# Altium schematic sheet Power.SchDoc
size 431 x 279 mm; SheetNumber: 2; SheetTotal: 6
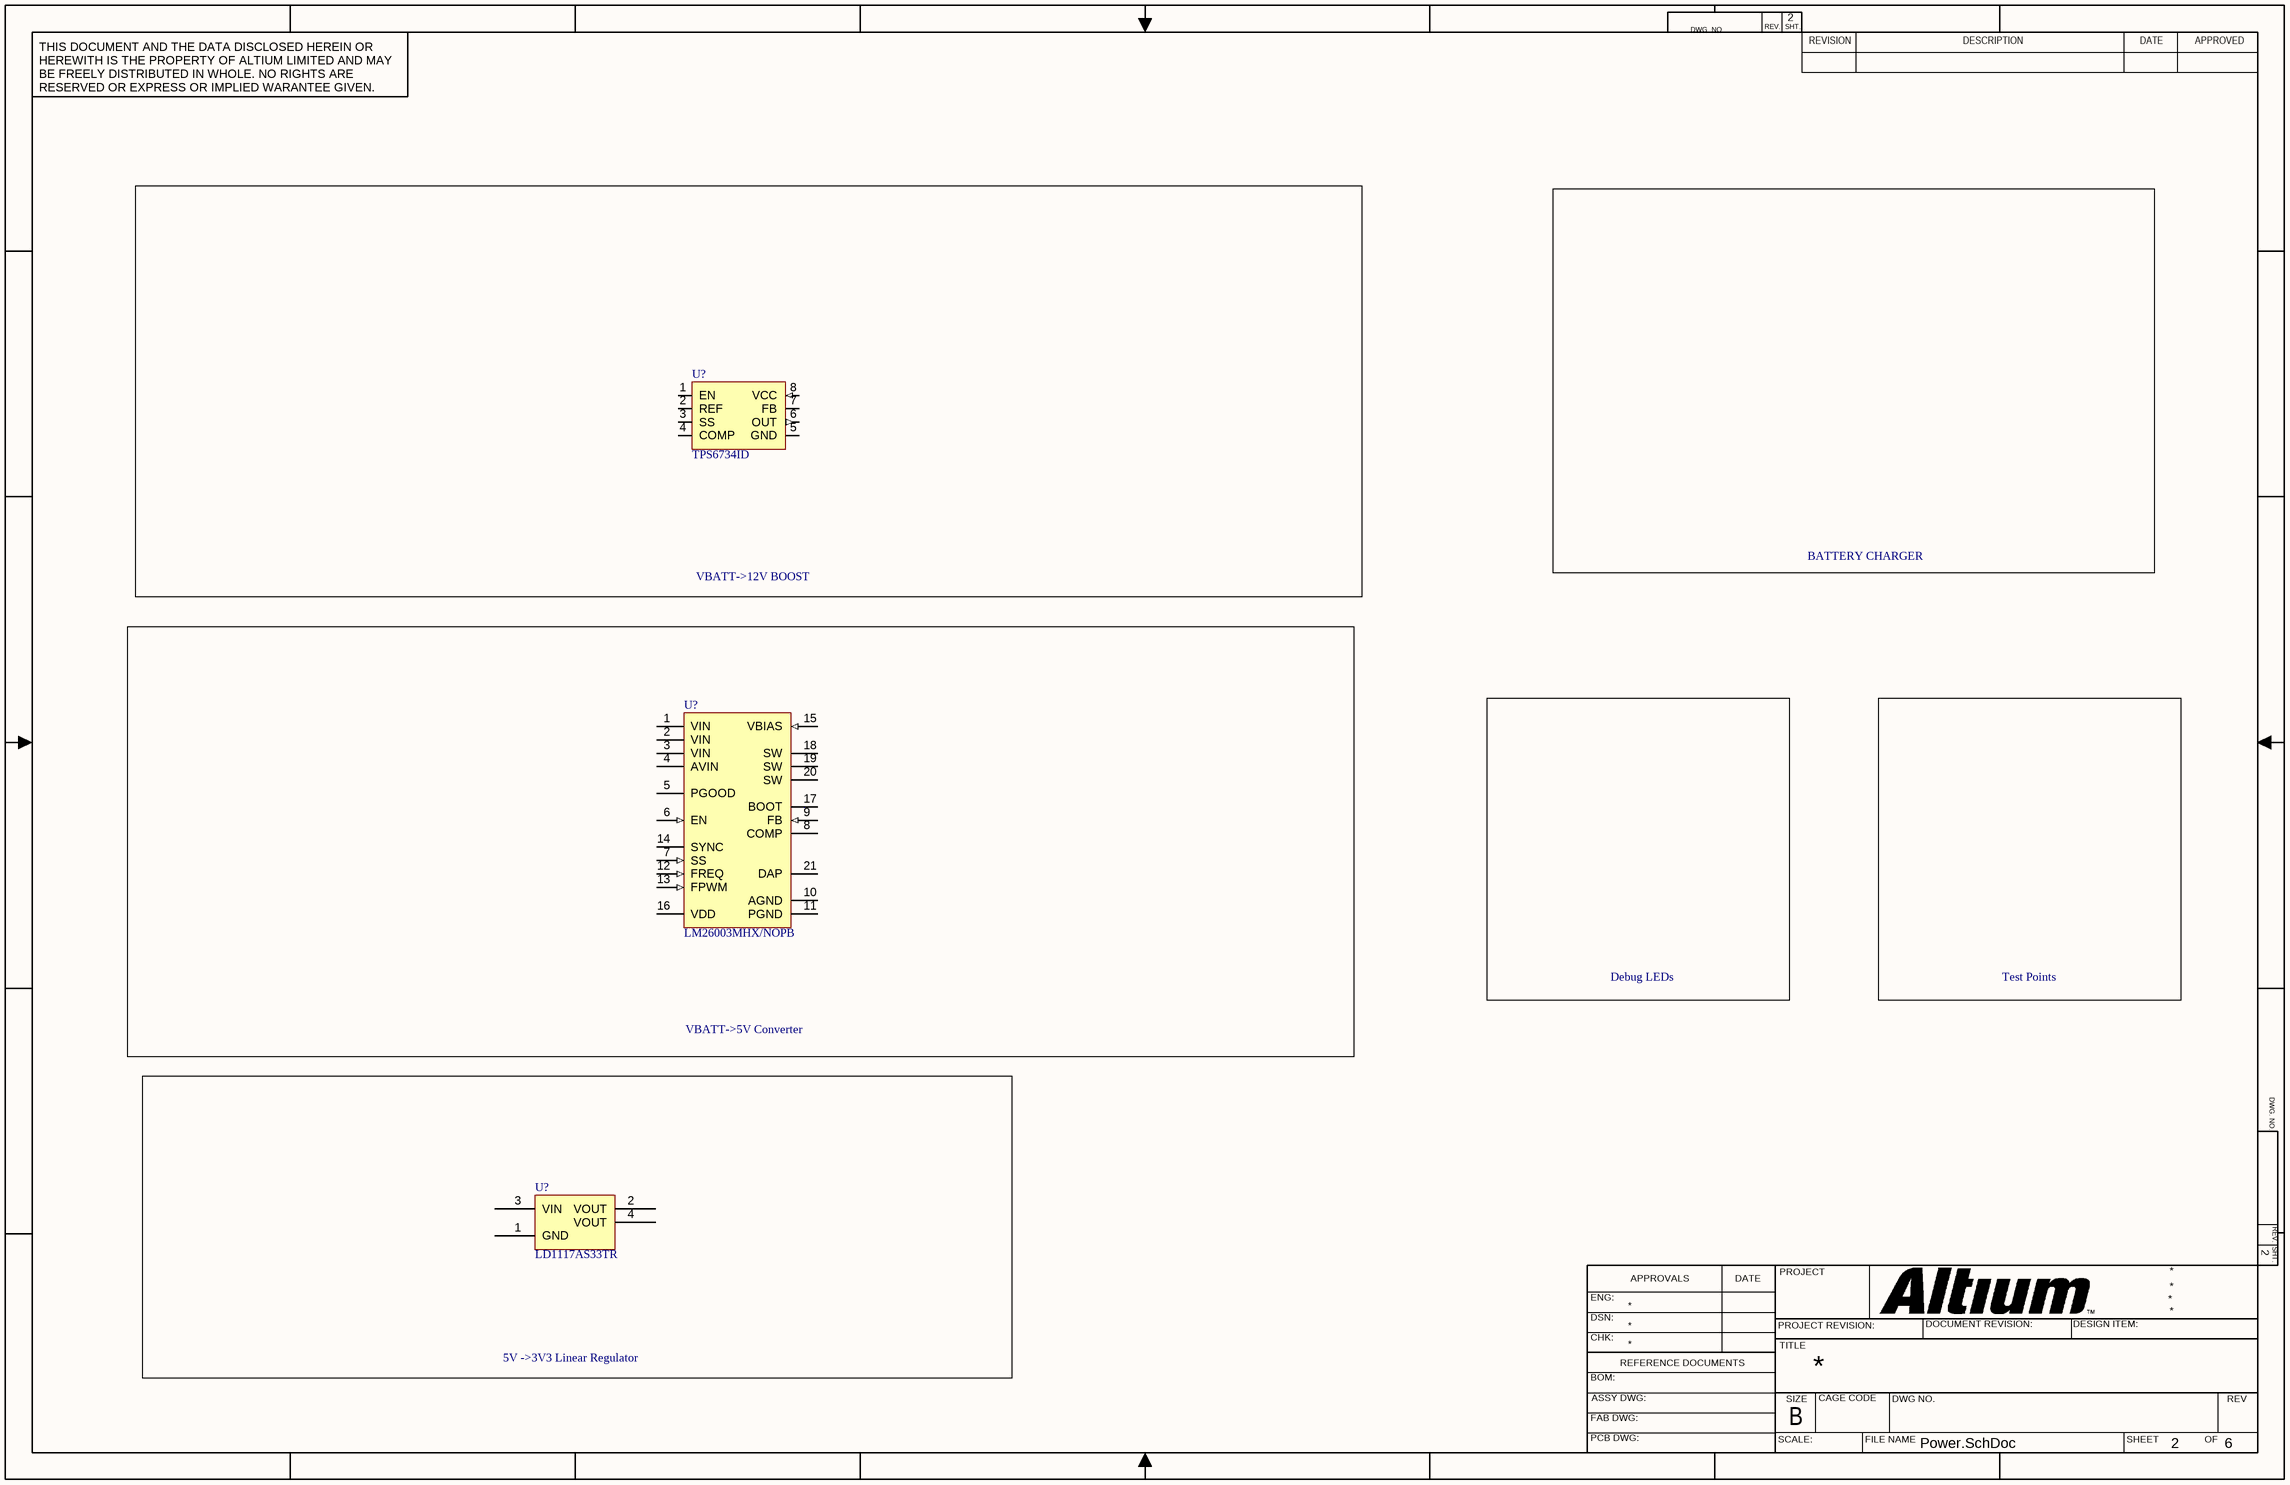
[diagram p0: Power.SchDoc]

## Parts
(Parts that share a designator on the sheet are numbered #1, #2 ... from top to bottom, then left to right.)
U?#1  TPS6734ID  [TI SOIC-8 D]
U?#2  LM26003MHX/NOPB  [PWP0020A_L]
U?#3  LD1117AS33TR  [ST SOT-223]

## Blocks framed on the sheet
VBATT->12V BOOST: U?#1
VBATT->5V Converter: U?#2
5V ->3V3 Linear Regulator: U?#3

## Nets

Not connected (* = marked no-connect by the designer): U?#1 1(EN) 2(REF) 3(SS) 4(COMP) 5(GND) 6(OUT) 7(FB) 8(VCC); U?#2 1(VIN) 2(VIN) 3(VIN) 4(AVIN) 5(PGOOD) 6(EN) 7(SS) 8(COMP) 9(FB) 10(AGND) 11(PGND) 12(FREQ) 13(FPWM) 14(SYNC) 15(VBIAS) 16(VDD) 17(BOOT) 18(SW) 19(SW) 20(SW) 21(DAP); U?#3 1(GND) 2(VOUT) 3(VIN) 4(VOUT)

## Notes on the sheet
- BATTERY CHARGER
- Debug LEDs
- Test Points
- DWG. NO.
- REV.
- SHT.
- THIS DOCUMENT AND THE DATA DISCLOSED HEREIN OR HEREWITH IS THE PROPERTY OF ALTIUM LIMITED AND MAY BE FREELY DISTRIBUTED IN WHOLE. NO RIGHTS ARE RESERVED OR EXPRESS OR IMPLIED WARANTEE GIVEN.
- REVISION
- DESCRIPTION
- DATE
- APPROVED
- ENG:
- APPROVALS
- PROJECT
- DSN:
- CHK:
- REFERENCE DOCUMENTS
- PROJECT REVISION:
- TITLE
- DOCUMENT REVISION:
- DESIGN ITEM:
- BOM:
- FAB DWG:
- PCB DWG:
- ASSY DWG:
- SCALE:
- SIZE
- B
- CAGE CODE
- FILE NAME
- DWG NO.
- SHEET
- OF
- REV

## Library data of the parts
U?#1 = CMP-001-0000-2: Switching Regulator, Current-Mode, 1.5A, 170kHz Switching Freq-Max, CMOS, PDSO8; Min Input Voltage: 2.7V; Efficiency: 86%; Max Output Current: 150mA; Nominal Supply Current: 2.5mA; Max Output Voltage: 12.6V; Output Configuration: Positive; Number of Outputs: 1; Output Voltage: 12.12V; Output Type: Fixed; Topology: Boost; Nominal Output Voltage: 12V; Output Power: 725mW; Synchronous Rectifier: No; Height: 1.58mm; Width: 3.91mm; Length: 4.9mm; RoHS Compliant: Yes; Switching Frequency: 170kHz; Max Operating Temperature: 85°C; Number of Pins: 8; Packaging: Rail/Tube; Radiation Hardening: No; Mount: Surface Mount; Output Current: 150mA; Reach SVHC Compliant: Yes; Min Output Voltage: 12.12V; Weight: 0.002677oz; Min Operating Temperature: -40°C; Package Quantity: 75; Lead Free: Lead Free; Operating Supply Voltage: 12V; Max Input Voltage: 12V; Series: -; Case/Package: SOIC
U?#2 = CMP-0069-01745-3: 3A Switching Regulator with High Efficiency Sleep Mode, 20-pin TSSOP-EP, Pb-Free; Manufacturer: Texas Instruments; CompType: Switcher; PackageTopMarking: NSUZXYTT*LM26003*MH; PowerWise: Y; PackageDescription: Molded TSSOP, Jedec, 6.5 x 4.4 x 0.9mm Body, 20 Lead, 0.65mm Pitch, Exposed Pad; Code_JEDEC: MO-153-ACT; PinCount: 20; ComponentLink1URL: http://www.ti.com/general/docs/lit/getliterature.tsp?genericPartNumber=LM26003&fileType=pdf; PackageReference: PWP0020A; RoHS: Y; ComponentLink1Description: Datasheet URL
U?#3 = LD1117AS33TR: IC REG LINEAR 3.3V 1A SOT223; Manufacturer: STMicroelectronics; Current - Quiescent (Iq): 10 mA; Number of Regulators: 1; Output Configuration: Positive; Output Type: Fixed; Protection Features: Over Current, Over Temperature; PSRR: 75dB (120Hz); Voltage Dropout (Max): 1.3V @ 1A; Voltage - Input (Max): 15V; Part Number: LD1117AS33TR; ComponentLink1Description: Datasheet; ComponentLink1URL: http://www.st.com/content/ccc/resource/technical/document/datasheet/a5/c3/3f/c9/2b/15/40/49/CD00002116.pdf/files/CD00002116.pdf/jcr:content/translations/en.CD00002116.pdf; ComponentLink2Description: DigiKey Link; ComponentLink2URL: https://www.digikey.com/en/products/detail/stmicroelectronics/LD1117AS33TR/585752; Current - Output: 1A; LastUpdated: 2022-09-19 1:59:38 PM; Lifecycle Status: Active; Minimum Order: 1; Mounting Type: Surface Mount; Operating Temperature: 0°C ~ 125°C; Package / Case: TO-261-4, TO-261AA; Packaging: TapeAndReel; Part Status: Active; Price: 0.45; Series: -; Supplier 1: DigiKey; Supplier Part Number 1: 497-1228-1-ND; Supplier Device Package: SOT-223; Voltage - Output (Min/Fixed): 3.3V